# EasyEDA schematic pictest_dram_2021-04-17.json
TITLE: Sheet_1; REV: 1.0; Date: 2021-04-16; Sheet: 1/1; Drawn By: sirrosh69; Company: Your Company
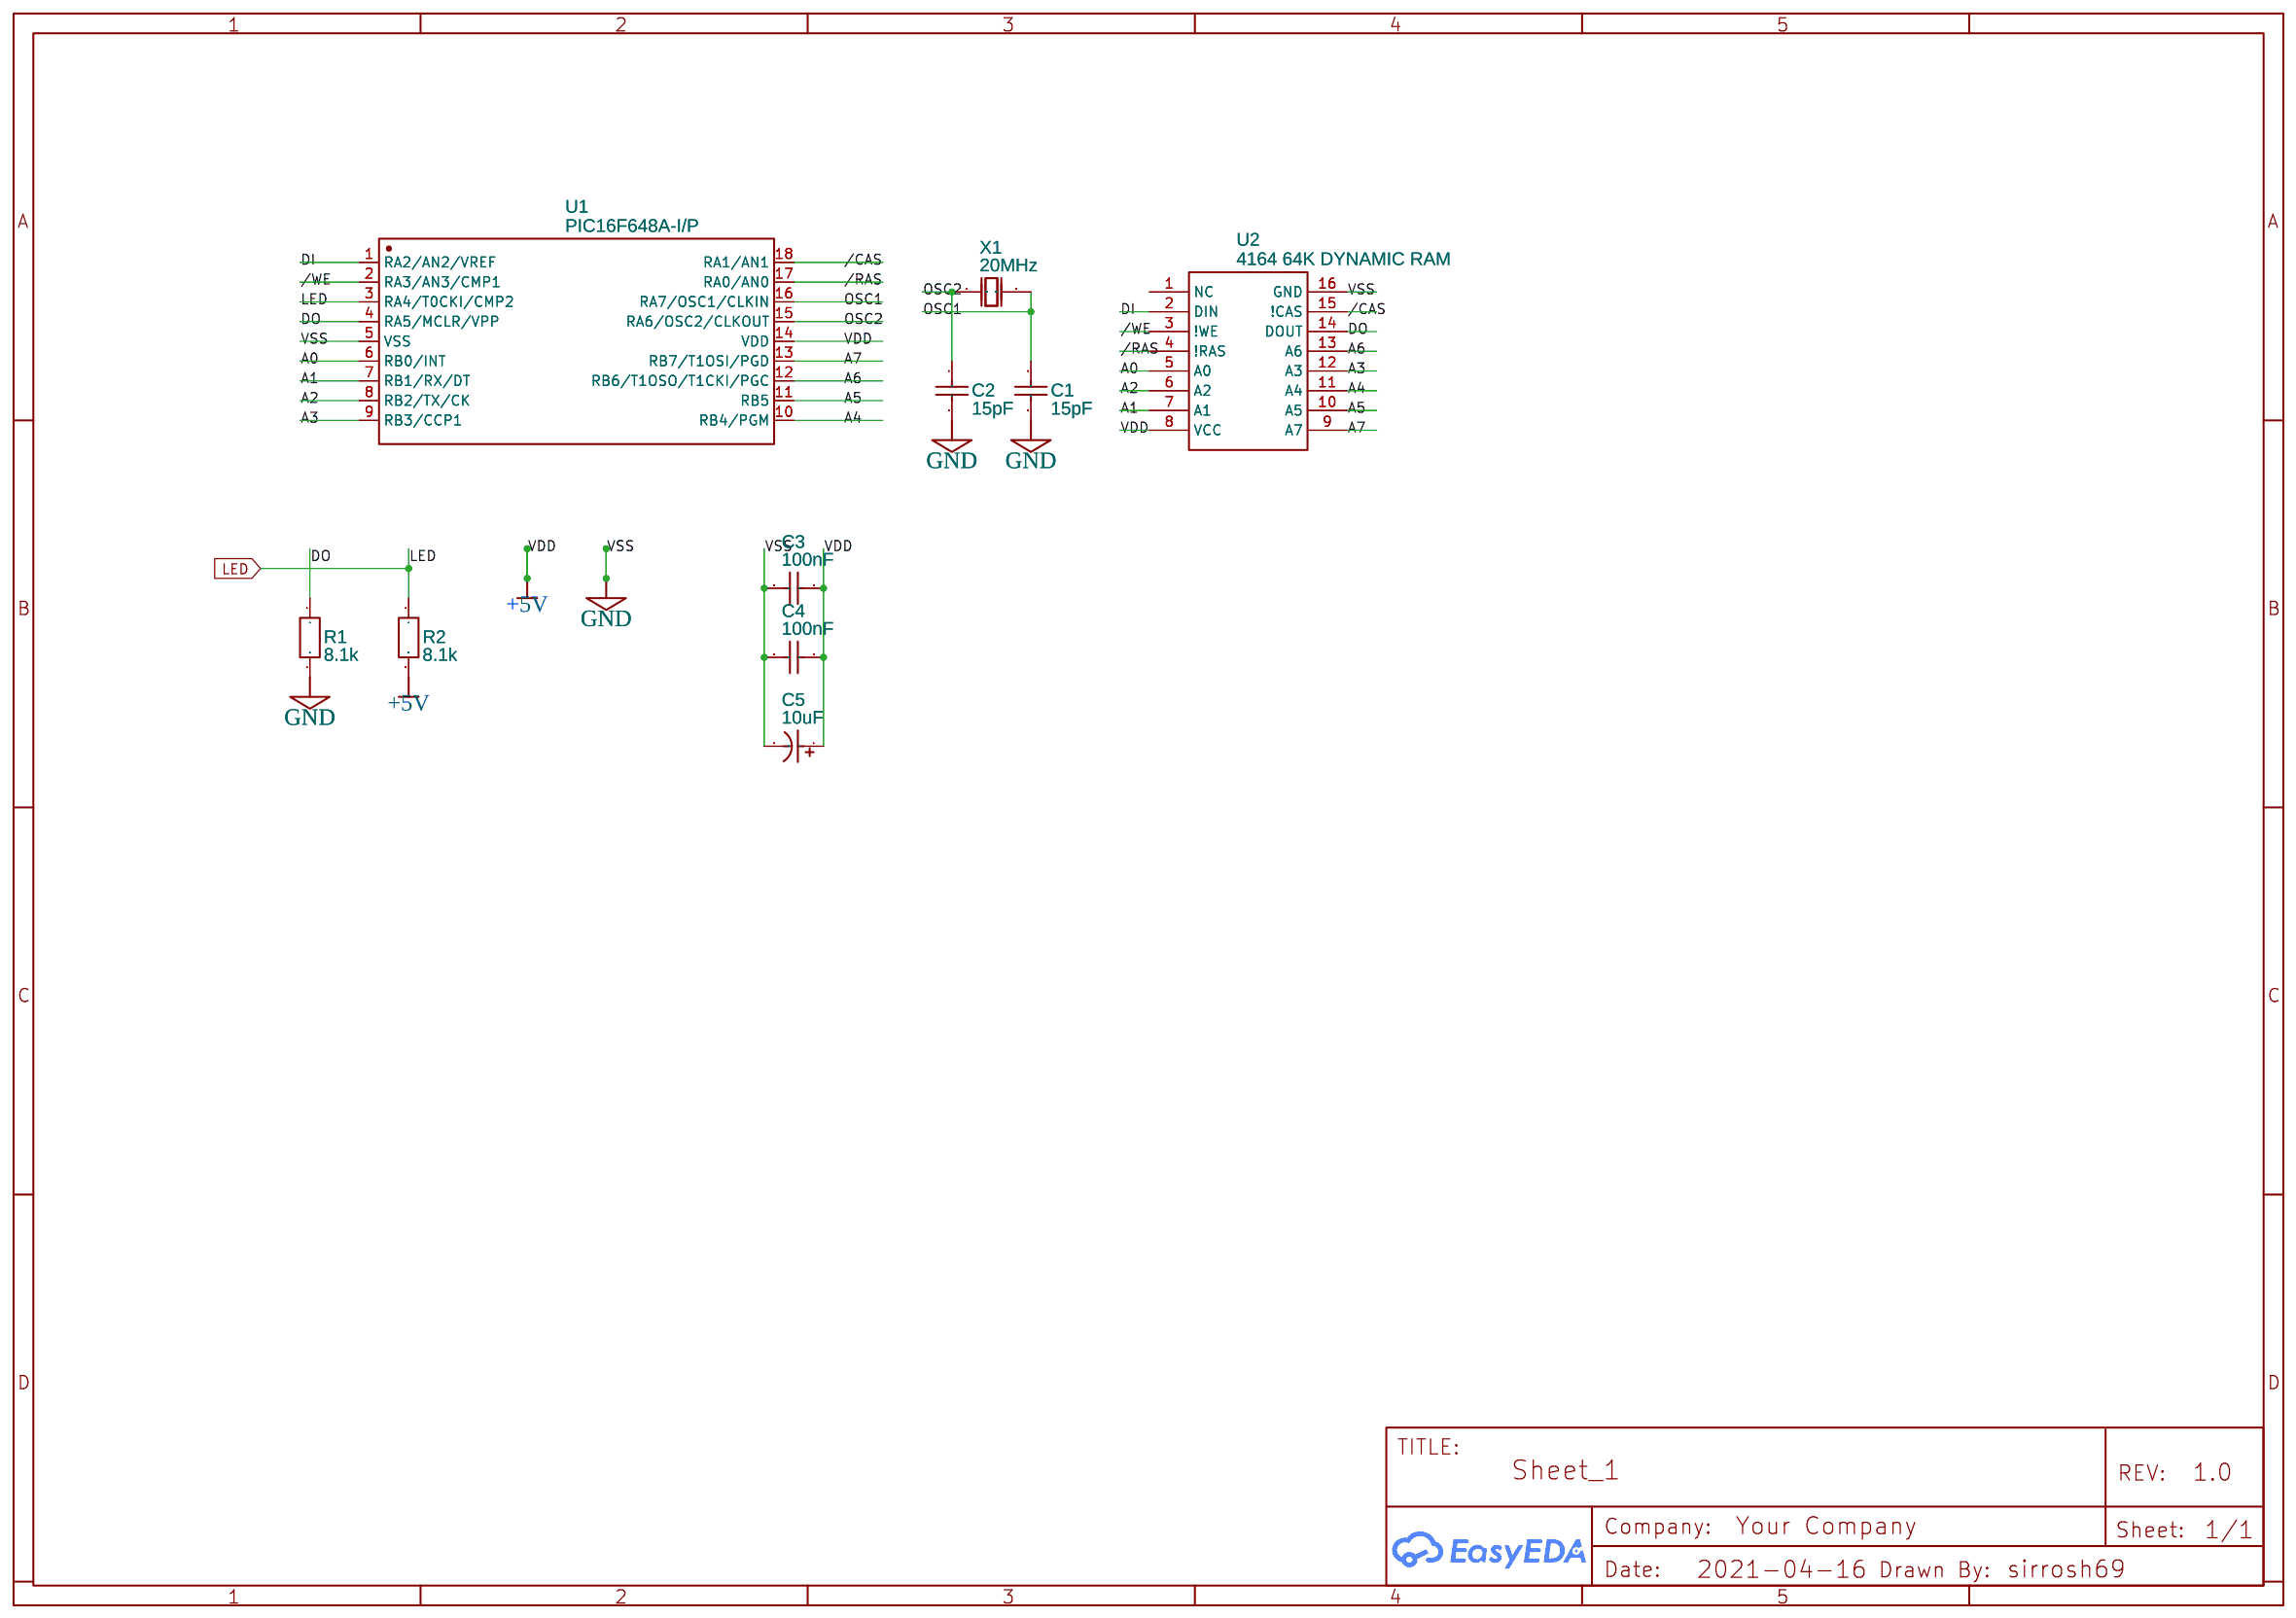
[diagram p0: schematic sheet]

## Parts
C1  15pF  [CAP-TH_L8.5-W5.0-P5.00-D1.2]
C2  15pF  [CAP-TH_L8.5-W5.0-P5.00-D1.2]
C3  100nF  [RAD-0.2]
C4  100nF  [RAD-0.2]
C5  10uF  [CAP-TH_BD5.0-P2.00-D0.8-FD]
R1  8.1k  [R0603]
R2  8.1k  [R0603]
U1  PIC16F648A-I/P  [DIP-18_L23.0-W6.5-P2.54-LS7.6-BL]
U2  4164 64K DYNAMIC RAM  [DIP16]
X1  20MHz  [HC-49S]

## Library data of the parts
C1 C2 = Monolithic 15pF (150) ±5%: Supplier: LCSC; Manufacturer: ReliaPro; Supplier Part: C32131
C3 C4 = 100nF: Supplier: LCSC; Manufacturer: LCSC; Manufacturer Part: 0.1UF(104) +-20% 63v; Supplier Part: C19355
C5 = 10uF 16V 5*11: Supplier: LCSC; Manufacturer: ValuePro; Supplier Part: C43799; LCSC Assembly: Yes; SMT Type: Extend; Paste Type: expand
R1 R2 = R_0603_EU: Contributor: LCEDA_Lib
U1 = PIC16F648A-I/P: Supplier: LCSC; Manufacturer: MICROCHIP; Supplier Part: C50894
U2 = 4164 64K DYNAMIC RAM: Manufacturer: HITACHI; Supplier Part: HM4864-3; Contributor: twahl
X1 = 49S DIP Crystal insulation film: Supplier: LCSC; Manufacturer: YXC; Supplier Part: C35018

## Nets
+5V: C3.2 C4.2 C5.1 R2.2 U1.14(VDD) U2.8(VCC)
GND: C1.1 C2.1 C3.1 C4.1 C5.2 R1.2 U1.5(VSS) U2.16(GND)
/CAS: U1.18(RA1/AN1) U2.15(!CAS)
/RAS: U1.17(RA0/AN0) U2.4(!RAS)
/WE: U1.2(RA3/AN3/CMP1) U2.3(!WE)
A0: U1.6(RB0/INT) U2.5(A0)
A1: U1.7(RB1/RX/DT) U2.7(A1)
A2: U1.8(RB2/TX/CK) U2.6(A2)
A3: U1.9(RB3/CCP1) U2.12(A3)
A4: U1.10(RB4/PGM) U2.11(A4)
A5: U1.11(RB5) U2.10(A5)
A6: U1.12(RB6/T1OSO/T1CKI/PGC) U2.13(A6)
A7: U1.13(RB7/T1OSI/PGD) U2.9(A7)
DI: U1.1(RA2/AN2/VREF) U2.2(DIN)
DO: R1.1 U1.4(RA5/MCLR/VPP) U2.14(DOUT)
LED: R2.1 U1.3(RA4/T0CKI/CMP2)
OSC1: C1.2 U1.16(RA7/OSC1/CLKIN) X1.2(OSC2)
OSC2: C2.2 U1.15(RA6/OSC2/CLKOUT) X1.1(OSC1)

Not connected (* = marked no-connect by the designer): U2 1(NC)
